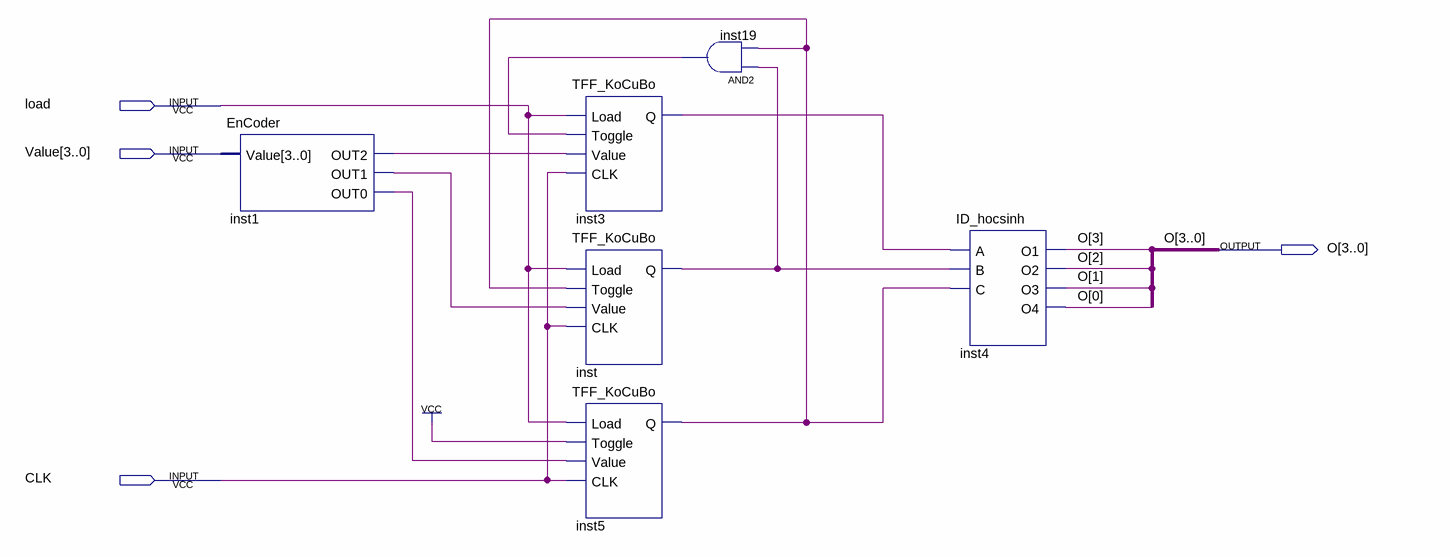
[diagram p0: schematic sheet]
// Quartus schematic Lab_06_KhongCuBo.bdf as structural Verilog: 6 symbols, 4 pins
module Lab_06_KhongCuBo (
  input  load,
  input  [3:0] Value,
  input  CLK,
  output [3:0] O
);

  wire inst1_out0, inst1_out1, inst1_out2, inst3_q, inst5_q, inst19_out, inst_q;

  EnCoder inst1 (.Value(Value), .OUT2(inst1_out2), .OUT1(inst1_out1), .OUT0(inst1_out0));
  TFF_KoCuBo inst3 (.Load(load), .Toggle(inst19_out), .Value(inst1_out2), .CLK(CLK), .Q(inst3_q));
  TFF_KoCuBo inst (.Load(load), .Toggle(inst5_q), .Value(inst1_out1), .CLK(CLK), .Q(inst_q));
  TFF_KoCuBo inst5 (.Load(load), .Toggle(1'b1), .Value(inst1_out0), .CLK(CLK), .Q(inst5_q));
  and inst19 (inst19_out, inst_q, inst5_q);
  ID_hocsinh inst4 (.A(inst3_q), .B(inst_q), .C(inst5_q), .O1(O[3]), .O2(O[2]), .O3(O[1]), .O4(O[0]));
endmodule
